# EAGLE design TALON_SRX v2.0 (EAGLE 8.5.2)
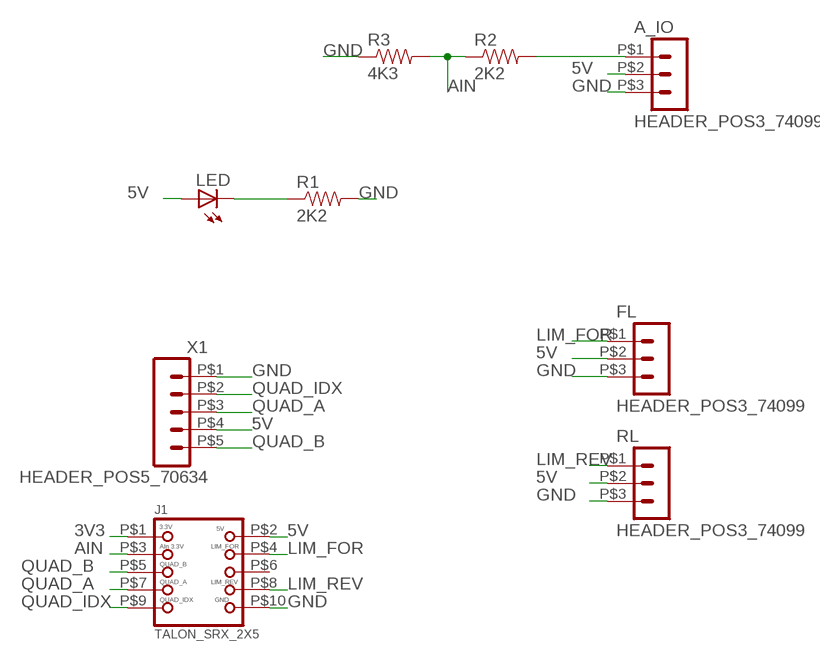
[diagram p0: schematic, sheet 1]

## Parts
A_IO  HEADER_POS3_74099  [74099-POS3]
FL  HEADER_POS3_74099  [74099-POS3]
J1  TALON_SRX_2X5  [2X5-0.05-HEADER]
LED  LEDSMT1206  [1206]
R1  2K2  RESISTOR1206  [1206]
R2  2K2  RESISTOR1206  [1206]
R3  4K3  RESISTOR1206  [1206]
RL  HEADER_POS3_74099  [74099-POS3]
X1  HEADER_POS5_70634  [70634-POS5]

## Nets
3V3: J1.P$1
5V: A_IO.P$2 FL.P$2 J1.P$2 LED.A RL.P$2 X1.P$4
AIN: J1.P$3 R2.1 R3.2
GND: A_IO.P$3 FL.P$3 J1.P$10 R1.2 R3.1 RL.P$3 X1.P$1
LIM_FOR: FL.P$1 J1.P$4
LIM_REV: J1.P$8 RL.P$1
N$5: A_IO.P$1 R2.2
N$10: LED.C R1.1
QUAD_A: J1.P$7 X1.P$3
QUAD_B: J1.P$5 X1.P$5
QUAD_IDX: J1.P$9 X1.P$2
Unconnected: J1.P$6

## Library data of the parts
A_IO FL RL = con-molex-c-grid-sl:HEADER_POS3_?: Molex -C-Grid® / SL Series connector Wire-to-Board 2.54 mm (0.100") pitch header, 3 positions.
J1 = Peter:TALON_SRX_2X5
LED = adafruit:LED: LED OSRAM: - CHIPLED LG R971, LG N971, LY N971, LG Q971, LY Q971, LO R971, LY R971 LH N974, LH R974 LS Q976, LO Q976, LY Q976 LO Q996 - Hyper CHIPLED LW Q18S LB Q993, LB Q99A, LB R99A - SideLED LS A670, LO A670, LY A670, LG A670, LP A670 LB A673, LV A673, LT A673, LW A673 LH A674 LY A675 LS A676, LA A676, LO A676, LY A676, LW A676 LS A679, LY A679, LG A679 - Hyper Micro SIDELED® LS Y876, LA Y876, LO Y876, LY Y876 LT Y87S - SmartLED LW L88C, LW L88S LB L89C, LB L89S, LG L890 LS L89K, LO L89K, LY L89K LS L896, LA L896, LO L896, LY L896 - TOPLED LS T670, LO T670, LY T670, LG T670, LP T670 LSG T670, LSP T670, LSY T670, LOP T670, LYG T670 LG T671, LOG T671, LSG T671 LB T673, LV T673, LT T673, LW T673 LH T674 LS T676, LA T676, LO T676, LY T676, LB T676, LH T676, LSB T676, LW T676 LB T67C, LV T67C, LT T67C, LS T67K, LO T67K, LY T67K, LW E67C LS E67B, LA E67B, LO E67B, LY E67B, LB E67C, LV E67C, LT E67C LW T67C LS T679, LY T679, LG T679 LS T770, LO T770, LY T770, LG T770, LP T770 LB T773, LV T773, LT T773, LW T773 LH T774 LS E675, LA E675, LY E675, LS T675 LS T776, LA T776, LO T776, LY T776, LB T776 LHGB T686 LT T68C, LB T68C - Hyper Mini TOPLED® LB M676 - Mini TOPLED Santana® LG M470 LS M47K, LO M47K, LY M47K Source: http://www.osram.convergy.de/
R1-R3 = SparkFun-Passives:RESISTOR: Resistor Basic schematic elements and footprints for 0603, 1206, and PTH resistors.
X1 = con-molex-c-grid-sl:HEADER_POS5_?: Molex -C-Grid® / SL Series connector Wire-to-Board 2.54 mm (0.100") pitch header, 5 positions.

## Board
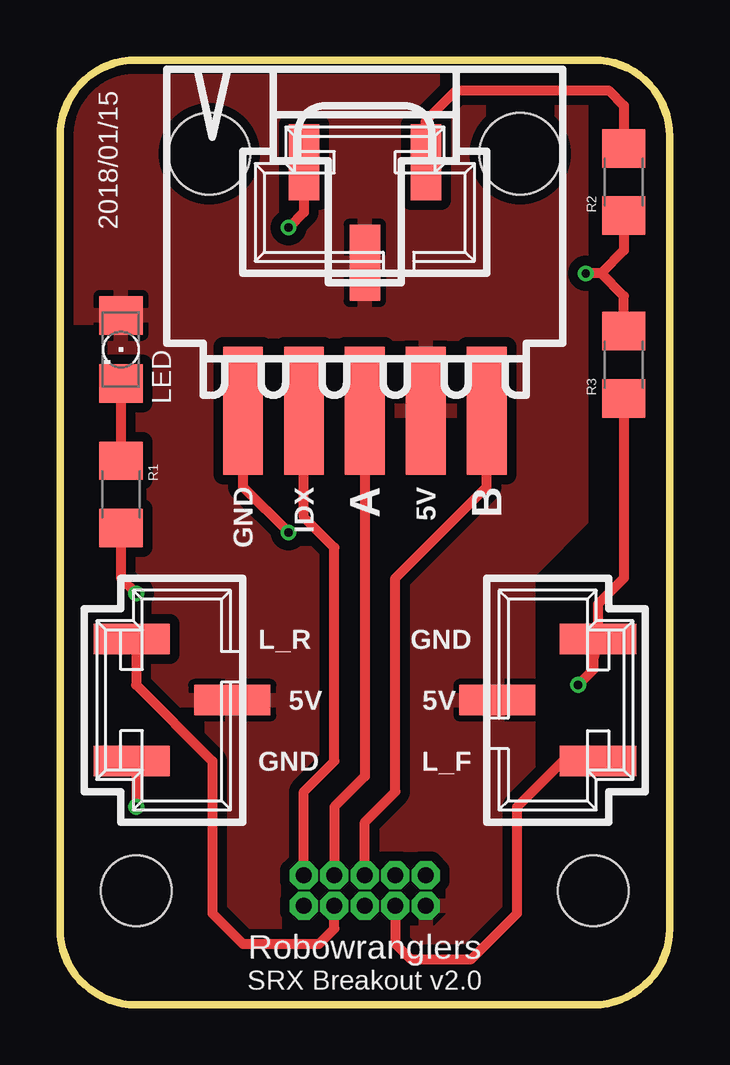
[diagram p1: board, top side]
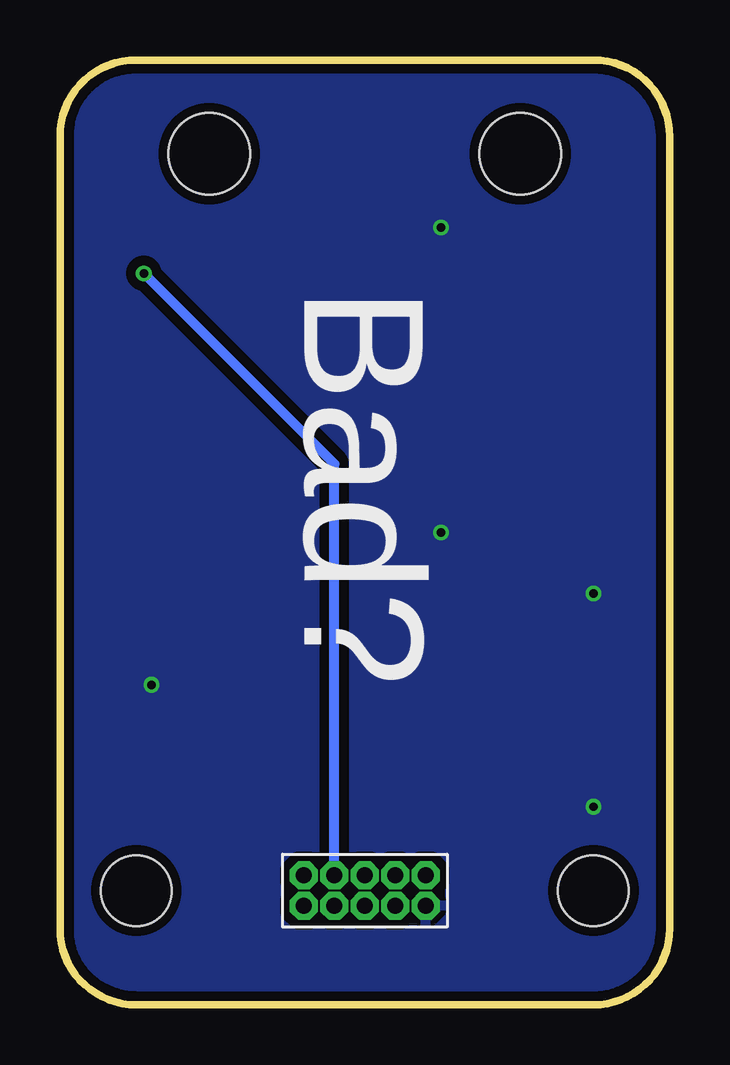
[diagram p2: board, bottom side, seen from below]

Size 25.4 x 39.37 mm. Coordinates in mm from the lower left corner, seen from the top.
Outline: 3.17,39.37 22.23,39.37 arc-90 25.4,36.2 25.4,3.17 arc-90 22.23,0 3.17,0 arc-90 0,3.17 0,36.2 arc-90 3.17,39.37
Copper layers (1*16): Top 0.035mm / dielectric 1.5mm / Bottom 0.035mm
Design rules "SeeedStudio_2layer_DRU_no_angle_20140221": minimum track width 6mil, minimum drill 12mil, track to track 6mil, track to pad 6mil, pad to pad 6mil, via to via 6mil, smd to smd 0mil, copper to edge 10mil, drill to drill 10mil, minimum pad ring 10mil, minimum via ring 6mil, stop-mask expansion 2mil, vias tented up to drill 100mil, thermal gap 10mil
Holes 2.95 mm at 3.17,4.76 22.23,4.76
tKeepout: area 4.7,8.3 to 7.9,41.3; area 11.1,8.3 to 14.3,41.3; area 17.5,8.3 to 20.7,41.3

### Footprints (pad centres in the part's own frame; a part is rotated, then mirrored left to right if it is on the bottom)
74099-POS3 = smd 1.27 x 3.175: P$1 2.54,2.095; P$2 0,-2.095; P$3 -2.54,2.095
2X5-0.05-HEADER = drill 0.66 octagon: P$1 2.54,-0.635; P$2 2.54,0.635; P$3 1.27,-0.635; P$4 1.27,0.635; P$5 0,-0.635; P$6 0,0.635; P$7 -1.27,-0.635; P$8 -1.27,0.635; P$9 -2.54,-0.635; P$10 -2.54,0.635
1206 = smd 1.6 x 1.803: A -1.422,0; C 1.422,0
1206' = smd 1.6 x 1.8: 1 -1.4,0; 2 1.4,0
70634-POS5 = smd 1.651 x 5.334: P$1 -5.08,0; P$2 -2.54,0; P$3 0,0; P$4 2.54,0; P$5 5.08,0 | hole 3.404: -6.477,10.693; 6.477,10.693

### Placement (x,y rotation side)
A_IO  12.7,33.02 0 top
FL  20.32,12.7 270 top
J1  12.7,4.76 180 bottom
LED  2.54,27.3 270 top
R1  2K2  [1206']  2.54,21.27 270 top
R2  2K2  [1206']  23.5,34.29 90 top
R3  4K3  [1206']  23.5,26.67 90 top
RL  5.08,12.7 90 top
X1  12.7,24.77 0 top

### Tracks (layer width: path | path; a pad name or v marks a point on that pad's centre or on a via)
5V
  pour Top (isolate 0.406): -1.91,41.91 -1.91,-1.91 28.57,-1.91 28.57,41.27
AIN  (via drill 0.35)
  Top 0.406: R2.1 23.5,31.43 22.54,30.48 | 22.54,30.48 v21.91,30.48 | R3.2 23.5,29.53 22.54,30.48
  Bottom 0.406: J1.P$3 13.97,22.54 v21.91,30.48
GND  (via drill 0.35)
  Top 0.406: v21.59,13.34 22.23,13.97 22.23,14.41 FL.P$3 22.42,16.7 23.5,17.78 R3.1 | X1.P$1 7.62,21.59 v9.53,19.68 | RL.P$3 3.17,10.6 v3.17,8.26 | R1.2 2.54,17.78 v3.17,17.14 | A_IO.P$3 10.16,33.02 v9.53,32.38
  pour Bottom (isolate 0.406): -1.91,41.91 27.3,41.91 27.3,-1.91 -1.91,-1.91
LIM_FOR
  Top 0.406: FL.P$1 20.95,10.16 19.05,8.26 19.05,3.81 17.14,1.91 14.61,1.91 13.97,2.54 J1.P$4
LIM_REV
  Top 0.406: RL.P$1 3.17,15.05 3.17,13.34 6.35,10.16 6.35,3.81 7.62,2.54 10.79,2.54 11.43,3.17 J1.P$8
N$5
  Top 0.406: A_IO.P$1 15.24,36.83 16.51,38.1 22.86,38.1 23.5,37.47 R2.2
N$7
  cutout Top: 12.7,22.23 16.51,22.23 16.51,21.59 14.61,19.05 12.7,19.05
N$8
  cutout Top: 0,28.26 1.91,28.26 1.91,18.41 3.17,17.14 3.17,15.88 -0.64,15.88 0,16.51
N$9
  cutout Top: 20.95,14.61 20.95,10.79 25.4,10.79 25.4,14.61
N$10
  Top 0.406: LED.C R1.1
N$11
  cutout Top: 26.35,40.64 22.23,40.64 22.23,20 20,17.78 20,4.13 26.35,4.13
QUAD_A
  Top 0.406: X1.P$3 12.7,9.53 11.43,8.26 J1.P$7
QUAD_B
  Top 0.406: J1.P$5 12.7,7.62 13.97,8.89 13.97,17.78 17.78,21.59 X1.P$5
QUAD_IDX
  Top 0.406: J1.P$9 10.16,8.89 11.43,10.16 11.43,19.05 10.16,20.32 X1.P$2

### Text on the board
tNames: 2018/01/15 | GND | IDX | A | 5V | B | L_R | GND | 5V | 5V | GND | L_F | Robowranglers | SRX Breakout v2.0
bNames: Bad?